# EAGLE board SparkFun_LTE_GNSS_Breakout_SARA-R510M8S (EAGLE 9.5.2)
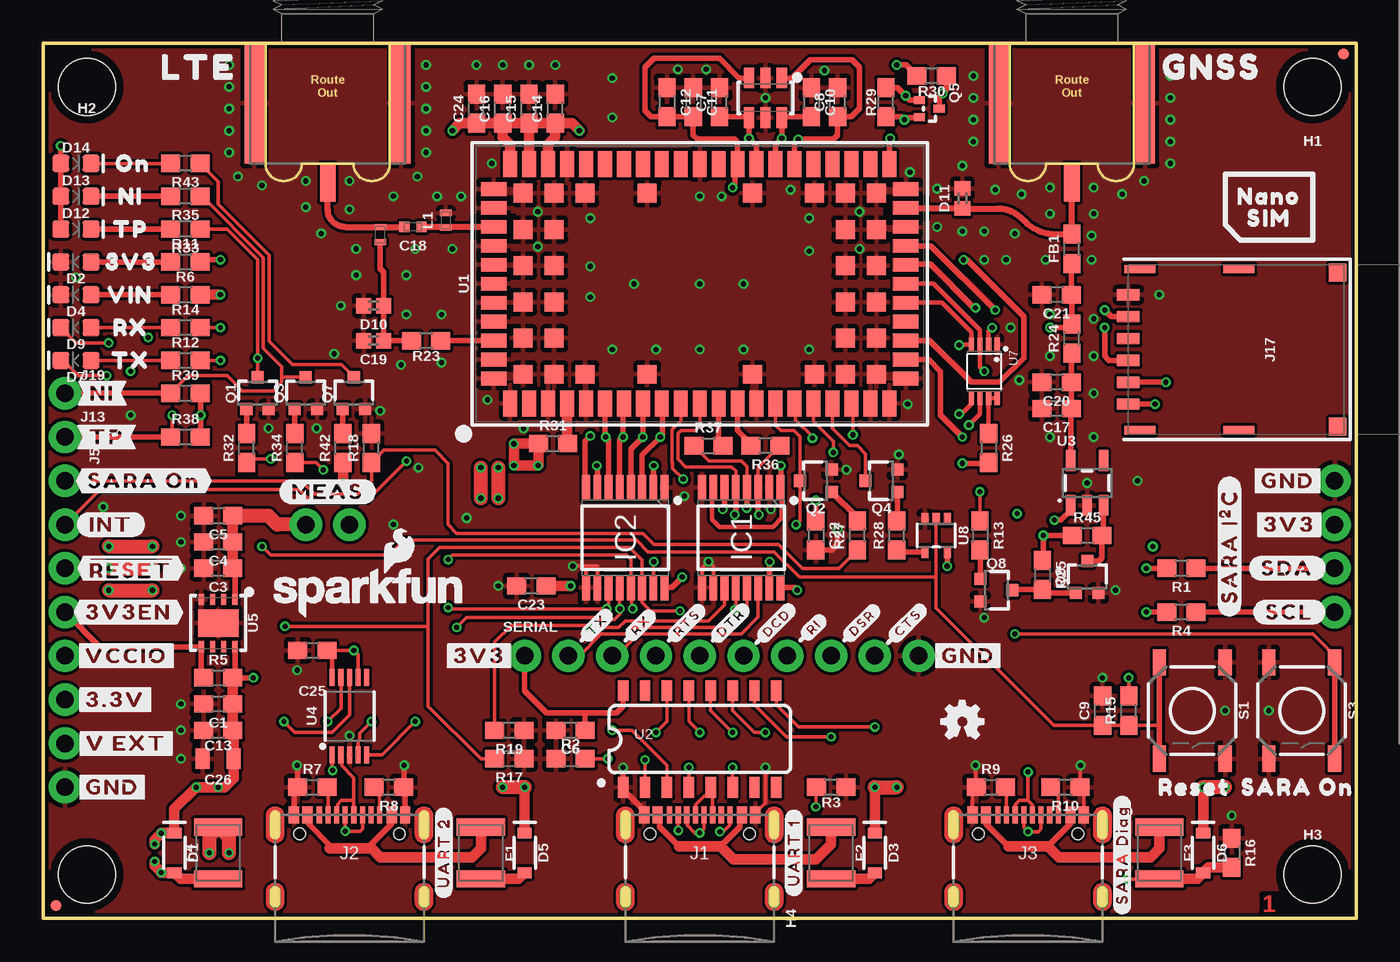
[diagram p1: board, top side]
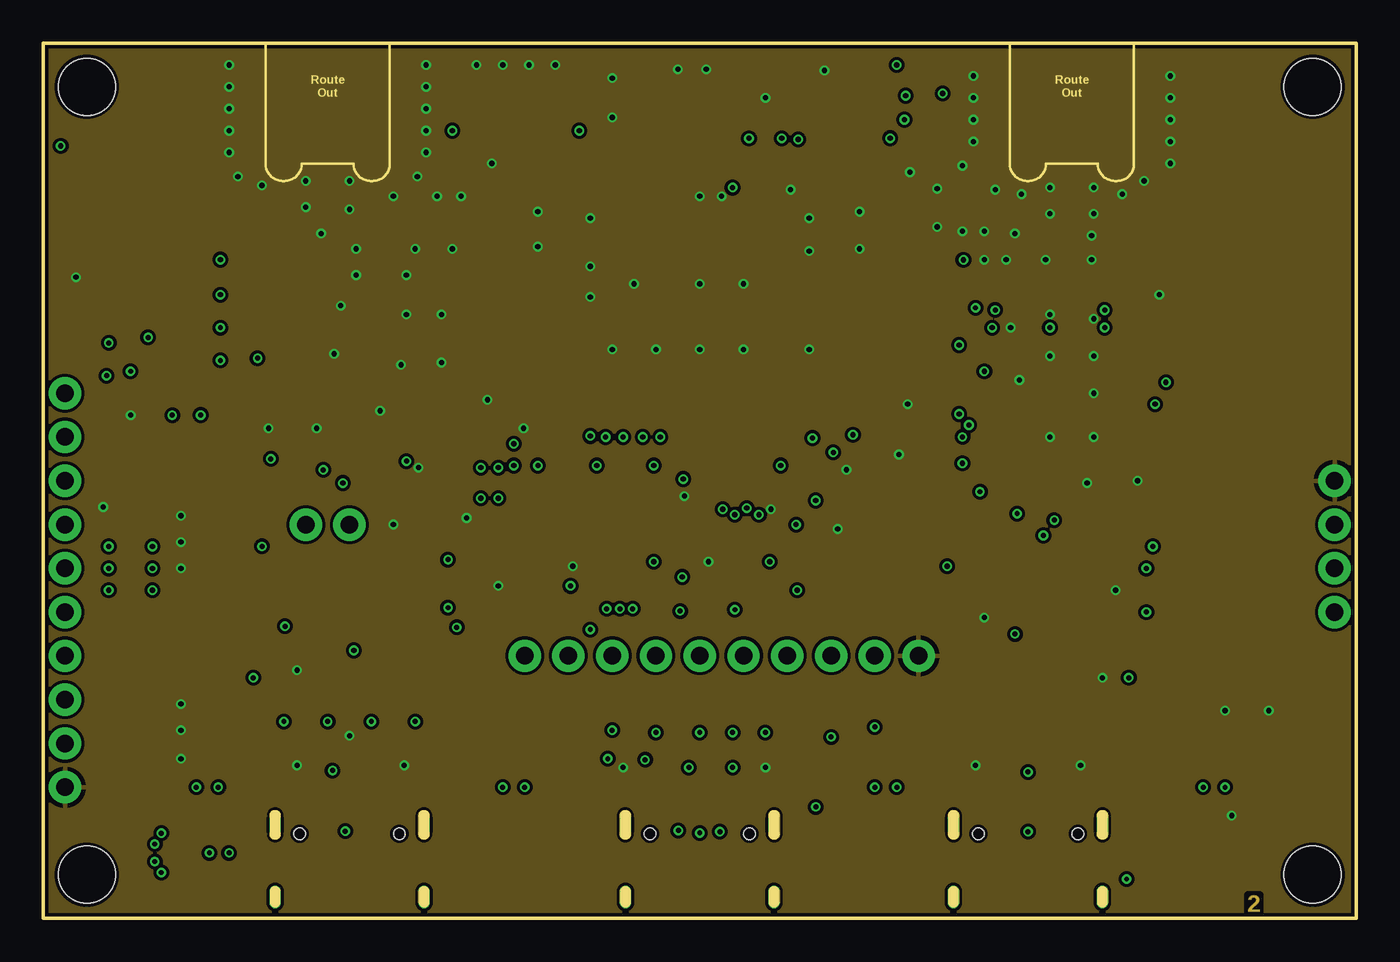
[diagram p2: board, inner layer Route2]
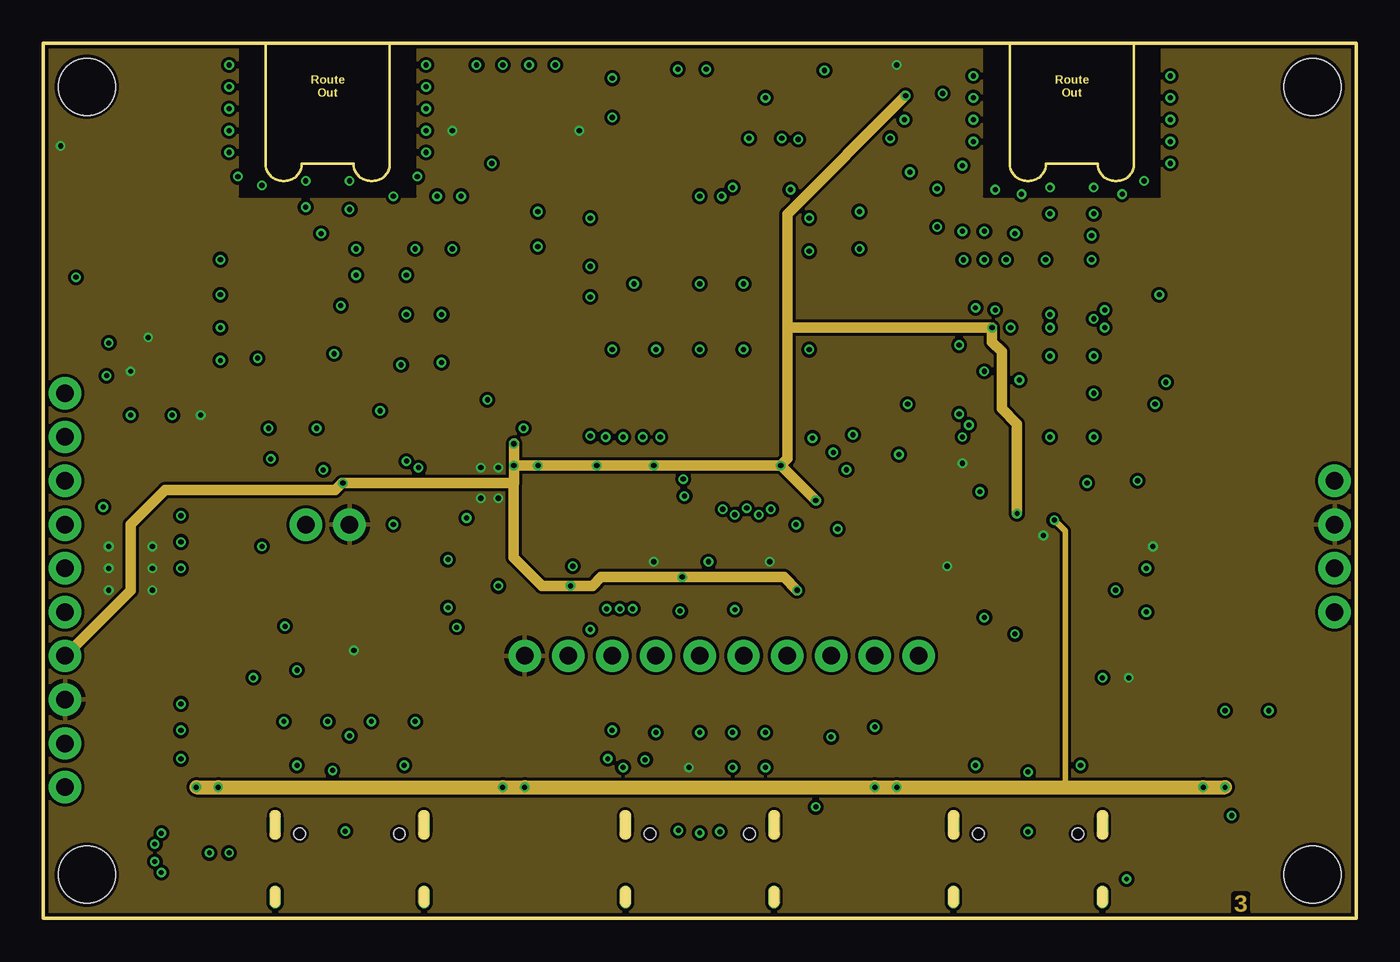
[diagram p3: board, inner layer Route15]
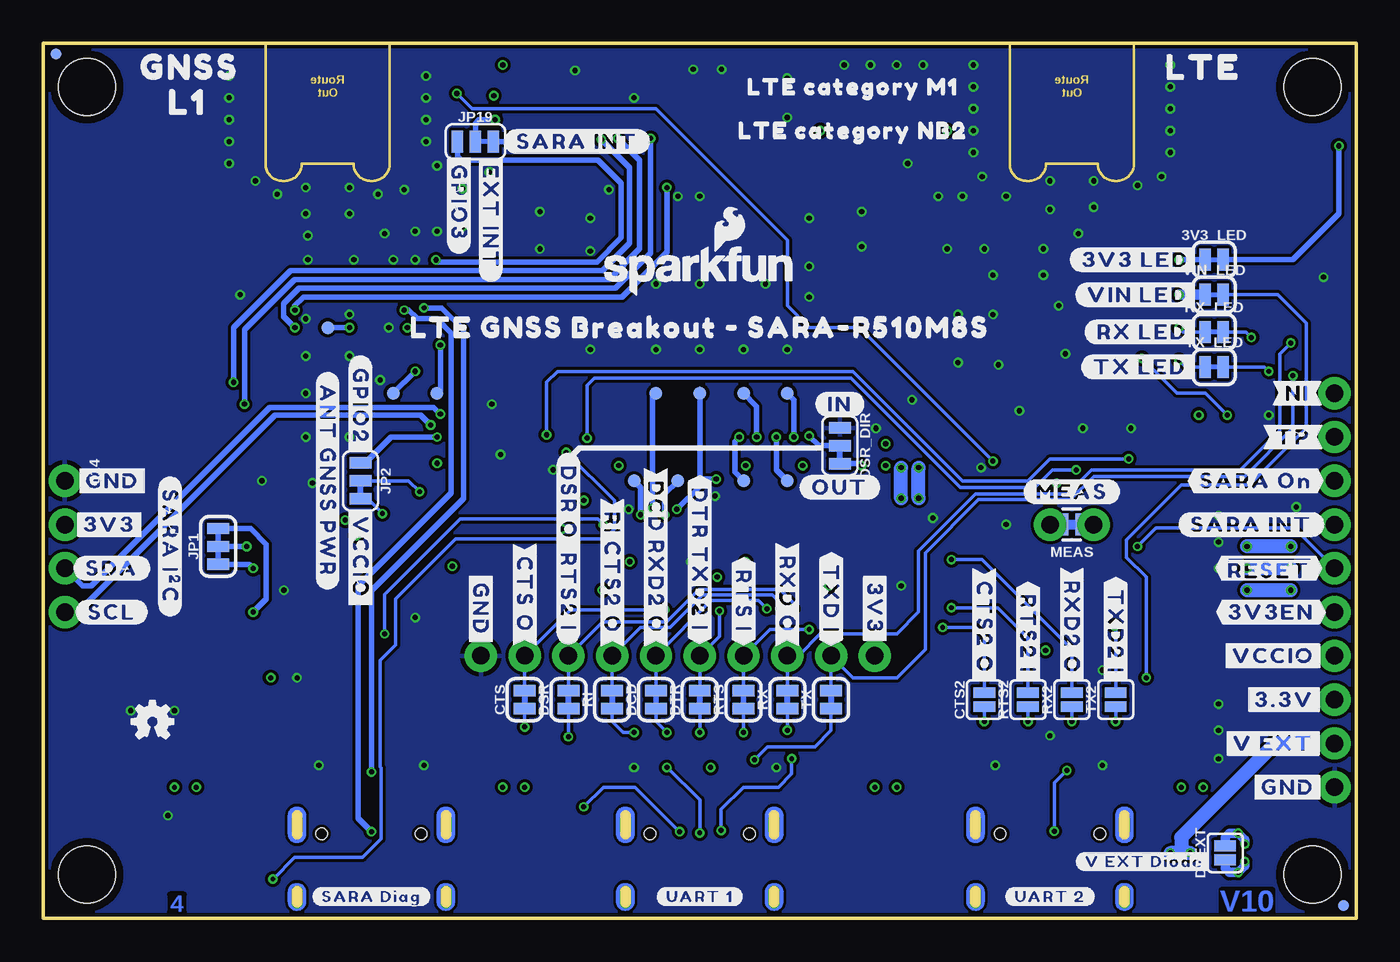
[diagram p4: board, bottom side, seen from below]

Size 76.2 x 50.8 mm. Coordinates in mm from the lower left corner, seen from the top.
Outline: 0,0 0,50.8 76.2,50.8 76.2,0 0,0
Copper layers (1+2*15+16): Top 0.035mm / dielectric 0.2mm / Route2 0.0175mm / dielectric 1.065mm / Route15 0.0175mm / dielectric 0.2mm / Bottom 0.035mm
Design rules "SparkFun-4-layer-1oz-JLCPCB": minimum track width 5mil, minimum drill 0.2mm, track to track 5mil, track to pad 0.2mm, pad to pad 5mil, via to via 0.2mm, smd to smd 0mil, copper to edge 0.2mm, drill to drill 10mil, minimum pad ring 0.13mm, minimum via ring 0.13mm, stop-mask expansion 0.05mm, vias tented up to drill 25mil, thermal gap 10mil
Net classes: 0 default: width 0 mm, drill 0 mm; 1 power: width 0.762 mm

## Footprints (pad centres in the part's own frame; a part is rotated, then mirrored left to right if it is on the bottom)
SMT-JUMPER_2_NC_TRACE_SILK = smd 0.66 x 1.27: 1 -0.521,0; 2 0.521,0
0603 = smd 1.1 x 1: 1 -0.85,0; 2 0.85,0
0402-TIGHT = smd 0.6 x 0.6: 1 -0.5,0; 2 0.5,0
0402 = smd 0.85 x 0.9: 1 -0.58,0; 2 0.58,0
0805 = smd 0.8 x 1.2: 1 -0.9,0; 2 0.9,0
SMT-JUMPER_2_NO_SILK = smd 0.635 x 1.27: 1 -0.406,0; 2 0.406,0
SOD-323 = smd 0.63 x 0.83: A 1.15,0; C -1.15,0
LED-0603 = smd 1 x 1: A -0.877,0; C 0.877,0
SOT23-6L = smd 0.6 x 1.2: 1 -0.95,-1.15; 2 0,-1.15; 3 0.95,-1.15; 4 0.95,1.15; 5 0,1.15; 6 -0.95,1.15
SMT-JUMPER_3_1-NC_TRACE_SILK = smd 0.66 x 1.27: 1 -1.041,0; 2 0,0; 3 1.041,0
SMA-EDGE-SMD = smd 1.15 x 7: GND@0 -4.25,-3.5; GND@1 4.25,-3.5 | smd 0.9 x 2.2: SIG 0,-8.1
1210 = smd 1 x 2.8: 1 -1.5,0; 2 1.5,0
FIDUCIAL-MICRO = smd 0.635 x 0.635: 1 0,0
STAND-OFF = hole 3.302: 0,0
SOP65P640X120-16N = smd 1.5 x 0.45: 1 -2.9,2.275; 2 -2.9,1.625; 3 -2.9,0.975; 4 -2.9,0.325; 5 -2.9,-0.325; 6 -2.9,-0.975; 7 -2.9,-1.625; 8 -2.9,-2.275; 9 2.9,-2.275; 10 2.9,-1.625; 11 2.9,-0.975; 12 2.9,-0.325; 13 2.9,0.325; 14 2.9,0.975; 15 2.9,1.625; 16 2.9,2.275
USB-C-16P_4LAYER-PADS = smd 0.3 x 1: A5 -1.25,-0.34; A6 -0.25,-0.34; A7 0.25,-0.34; A8 1.25,-0.34; B5 1.75,-0.34; B6 0.75,-0.34; B7 -0.75,-0.34; B8 -1.75,-0.34 | smd 0.6 x 1: GND -3.225,-0.34; GND2 3.225,-0.34; VBUS1 -2.45,-0.34; VBUS2 2.45,-0.34 | drill 0.4 pad 0.6 long: SHLD1 -4.318,-0.915; SHLD2 4.318,-0.915; SHLD3 -4.318,-5.095; SHLD4 4.318,-5.095 | hole 0.65: -2.89,-1.445; 2.89,-1.445
1X08_NO_SILK = drill 1.016 pad 1.88: 1 0,0; 2 2.54,0; 3 5.08,0; 4 7.62,0; 5 10.16,0; 6 12.7,0; 7 15.24,0; 8 17.78,0
1X01_NO_SILK = drill 1.016 pad 1.88: 1 0,0
1X04_NO_SILK = drill 1.016 pad 1.88: 1 0,0; 2 2.54,0; 3 5.08,0; 4 7.62,0
NANO_SIM_WURTH_693043020611 = smd 0.65 x 1.3: C1 1.905,6.25; C2 -0.635,6.25; C3 -1.905,6.25; C5 3.175,6.25; C6 0.635,6.25; C7 -3.175,6.25 | smd 0.48 x 1.8: MNT1 -4.69,5.58; MNT2 4.66,5.58; MNT3 -4.69,-0.17; MNT4 4.66,-0.17 | smd 1.03 x 1: MNT5 -4.465,-5.89; MNT6 4.465,-5.89
SMT-JUMPER_3_2-NC_TRACE_SILK = smd 0.66 x 1.27: 1 -1.041,0; 2 0,0; 3 1.041,0
0402_COILCRAFT = smd 0.356 x 0.66: P$1 -0.432,0; P$2 0.432,0
COMBO-JUMPER_2_NC_TRACE = smd 0.635 x 1.27: 1 -0.508,0; 2 0.508,0 | drill 1.016 pad 1.88: 3 -1.27,0; 4 1.27,0
SOT323 = smd 0.7 x 0.7: 1 -0.65,-0.925; 2 0.65,-0.925; 3 0,0.925
SOT-416FL = smd 0.46 x 0.65: 1 -0.5,-1.1; 2 0.5,-1.1; 3 0,0.05
TACTILE_SWITCH_SMD_5.2MM = smd 1.524 x 0.762: 1 -2.794,1.905; 2 2.794,1.905; 3 -2.794,-1.905; 4 2.794,-1.905
1X10_NO_SILK = drill 1.016 pad 1.88: 1 0,0; 2 2.54,0; 3 5.08,0; 4 7.62,0; 5 10.16,0; 6 12.7,0; 7 15.24,0; 8 17.78,0; 9 20.32,0; 10 22.86,0
PAD.03X.03 = smd 0.762 x 0.762: P$1 0,0
SARA-LGA = smd 0.8 x 1.5: 1 -11,-6.95; 2 -9.9,-6.95; 3 -8.8,-6.95; 4 -7.7,-6.95; 5 -6.6,-6.95; 6 -5.5,-6.95; 7 -4.4,-6.95; 8 -3.3,-6.95; 9 -2.2,-6.95; 10 -1.1,-6.95; 11 0,-6.95; 12 1.1,-6.95; 13 2.2,-6.95; 14 3.3,-6.95; 15 4.4,-6.95; 16 5.5,-6.95; 17 6.6,-6.95; 18 7.7,-6.95; 19 8.8,-6.95; 20 9.9,-6.95; 21 11,-6.95; 33 11,6.95; 34 9.9,6.95; 35 8.8,6.95; 36 7.7,6.95; 37 6.6,6.95; 38 5.5,6.95; 39 4.4,6.95; 40 3.3,6.95; 41 2.2,6.95; 42 1.1,6.95; 43 0,6.95; 44 -1.1,6.95; 45 -2.2,6.95; 46 -3.3,6.95; 47 -4.4,6.95; 48 -5.5,6.95; 49 -6.6,6.95; 50 -7.7,6.95; 51 -8.8,6.95; 52 -9.9,6.95; 53 -11,6.95 | smd 1.5 x 0.8: 22 11.95,-5.5; 23 11.95,-4.4; 24 11.95,-3.3; 25 11.95,-2.2; 26 11.95,-1.1; 27 11.95,0; 28 11.95,1.1; 29 11.95,2.2; 30 11.95,3.3; 31 11.95,4.4; 32 11.95,5.5; 54 -11.95,5.5; 55 -11.95,4.4; 56 -11.95,3.3; 57 -11.95,2.2; 58 -11.95,1.1; 59 -11.95,0; 60 -11.95,-1.1; 61 -11.95,-2.2; 62 -11.95,-3.3; 63 -11.95,-4.4; 64 -11.95,-5.5 | smd 1.1 x 1.1: 65 -10.25,-5.25; 66 -10.25,-3.15; 67 -10.25,-1.05; 68 -10.25,1.05; 69 -10.25,3.15; 70 -10.25,5.25; 71 -8.45,-5.25; 72 -8.45,-3.15; 73 -8.45,-1.05; 74 -8.45,1.05; 75 -8.45,3.15; 76 -8.45,5.25; 77 -6.65,-5.25; 78 -6.65,5.25; 79 -3.05,-5.25; 80 -3.05,5.25; 81 3.05,-5.25; 82 3.05,5.25; 83 6.65,-5.25; 84 6.65,5.25; 85 8.45,-5.25; 86 8.45,-3.15; 87 8.45,-1.05; 88 8.45,1.05; 89 8.45,3.15; 90 8.45,5.25; 91 10.25,-5.25; 92 10.25,-3.15; 93 10.25,-1.05; 94 10.25,1.05; 95 10.25,3.15; 96 10.25,5.25
SO016 = smd 0.6 x 1.2: 1 -4.445,-2.8; 2 -3.175,-2.8; 3 -1.905,-2.8; 4 -0.635,-2.8; 5 0.635,-2.8; 6 1.905,-2.8; 7 3.175,-2.8; 8 4.445,-2.8; 9 4.445,2.8; 10 3.175,2.8; 11 1.905,2.8; 12 0.635,2.8; 13 -0.635,2.8; 14 -1.905,2.8; 15 -3.175,2.8; 16 -4.445,2.8
SOT23-5 = smd 0.55 x 1.2: 1 -0.95,-1.3; 2 0,-1.3; 3 0.95,-1.3; 4 0.95,1.3; 5 -0.95,1.3
MSOP10 = smd 1 x 0.3: 1 -2.25,1; 2 -2.25,0.5; 3 -2.25,0; 4 -2.25,-0.5; 5 -2.25,-1; 6 2.25,-1; 7 2.25,-0.5; 8 2.25,0; 9 2.25,0.5; 10 2.25,1
UDFN-8 = smd 0.3 x 0.65: 1 -0.975,-1.375; 2 -0.325,-1.375; 3 0.325,-1.375; 4 0.975,-1.375; 5 0.975,1.375; 6 0.325,1.375; 7 -0.325,1.375; 8 -0.975,1.375 | smd 2.35 x 1.6: EP 0,0
VSSOP_8PIN = smd 0.8 x 0.3: P1 -1.55,0.75; P2 -1.55,0.25; P3 -1.55,-0.25; P4 -1.55,-0.75; P5 1.55,-0.75; P6 1.55,-0.25; P7 1.55,0.25; P8 1.55,0.75
SOT353 = smd 0.42 x 0.7: 1 -0.65,-0.95; 2 0,-0.95; 3 0.65,-0.95; 4 0.65,0.95; 5 -0.65,0.95

## Placement (x,y rotation side)
3V3_LED  [SMT-JUMPER_2_NC_TRACE_SILK]  8.26,38.23 0 bottom
C1  0.1uF  [0603]  10.16,12.45 180 top
C3  4.7uF  [0603]  10.16,20.32 180 top
C4  0.1uF  [0603]  10.16,21.84 180 top
C5  0.22uF  [0603]  10.16,23.37 180 top
C6  0.1uF  [0603]  30.61,10.92 180 top
C7  47pF  [0603]  39.24,47.37 90 top
C8  47pF  [0603]  46.1,47.37 90 top
C9  0.1uF  [0603]  61.47,12.06 90 top
C10  47pF  [0603]  44.58,47.37 270 top
C11  47pF  [0603]  37.72,47.37 270 top
C12  0.1uF  [0603]  36.2,47.37 270 top
C13  0.22uF  [0603]  10.16,10.92 180 top
C14  0.1uF  [0603]  29.72,46.99 90 top
C15  68pF  [0603]  28.19,46.99 90 top
C16  10uF  [0603]  26.67,46.99 90 top
C17  1.0uF  [0603]  58.8,29.59 180 top
C18  33pF  [0402-TIGHT]  21.46,40.13 180 top
C19  27pF  [0402]  19.18,33.53 180 top
C20  0.1uF  [0603]  58.8,31.11 180 top
C21  47pF  [0603]  58.8,36.2 180 top
C22  0.1uF  [0603]  44.83,22.23 270 top
C23  0.1uF  [0603]  28.32,19.3 180 top
C24  15pF  [0603]  25.15,46.99 90 top
C25  0.1uF  [0603]  15.62,15.56 180 top
C26  10uF  [0805]  10.16,9.27 180 top
CTS  JUMPER-SMT_2_NC_TRACE_SILK  [SMT-JUMPER_2_NC_TRACE_SILK]  48.26,12.7 90 bottom
CTS2  JUMPER-SMT_2_NO_SILK  [SMT-JUMPER_2_NO_SILK]  21.59,12.7 90 bottom
D1  3A/10V/280mV  [SOD-323]  7.62,3.81 270 top
D2  RED  [LED-0603]  1.91,38.1 180 top
D3  3A/10V/280mV  [SOD-323]  48.26,3.81 270 top
D4  Yellow  [LED-0603]  1.91,36.2 180 top
D5  3A/10V/280mV  [SOD-323]  27.94,3.81 270 top
D6  3A/10V/280mV  [SOD-323]  67.31,3.81 270 top
D7  GREEN  [LED-0603]  1.91,32.38 180 top
D8  DT1042-04SO-7  [SOT23-6L]  41.91,47.62 180 top
D9  Yellow  [LED-0603]  1.91,34.29 180 top
D10  PESD0402  [0402]  19.18,35.56 180 top
D11  PESD0402  [0402]  53.34,41.78 90 top
D12  GREEN  [LED-0603]  1.91,40.01 0 top
D13  BLUE  [LED-0603]  1.91,41.91 0 top
D14  WHITE  [LED-0603]  1.91,43.81 0 top
DCD  JUMPER-SMT_2_NC_TRACE_SILK  [SMT-JUMPER_2_NC_TRACE_SILK]  40.64,12.7 90 bottom
DSR  JUMPER-SMT_2_NC_TRACE_SILK  [SMT-JUMPER_2_NC_TRACE_SILK]  45.72,12.7 90 bottom
DSR_DIR  JUMPER-SMT_3_1-NC_TRACE_SILK  [SMT-JUMPER_3_1-NC_TRACE_SILK]  29.97,27.43 270 bottom
DTR  JUMPER-SMT_2_NC_TRACE_SILK  [SMT-JUMPER_2_NC_TRACE_SILK]  38.1,12.7 90 bottom
DVEXT  JUMPER-SMT_2_NO_SILK  [SMT-JUMPER_2_NO_SILK]  7.62,3.81 90 bottom
E3  ANTENNA-SMA-GROUNDEDEDGE_SMA_SMD  [SMA-EDGE-SMD]  16.51,50.8 0 top
E4  ANTENNA-SMA-GROUNDEDEDGE_SMA_SMD  [SMA-EDGE-SMD]  59.69,50.8 0 top
F1  6V/2A  [1210]  25.4,3.81 270 top
F2  6V/2A  [1210]  45.72,3.81 270 top
F3  6V/2A  [1210]  64.77,3.81 270 top
F4  6V/2A  [1210]  10.16,3.81 90 top
FB1  30Ω/1.8A  [0603]  59.69,38.86 90 top
FD1  FIDUCIALUFIDUCIAL  [FIDUCIAL-MICRO]  0.76,0.76 0 top
FD2  FIDUCIALUFIDUCIAL  [FIDUCIAL-MICRO]  75.44,50.16 0 top
FD3  FIDUCIALUFIDUCIAL  [FIDUCIAL-MICRO]  0.76,0.76 0 bottom
FD4  FIDUCIALUFIDUCIAL  [FIDUCIAL-MICRO]  75.44,50.16 0 bottom
FRAME1  FRAME-LEDGER  [CREATIVE_COMMONS]  106.68,1.27 0 top  (outside the outline)
H1  STAND-OFF  [STAND-OFF]  73.66,48.26 0 top
H2  STAND-OFF  [STAND-OFF]  2.54,48.26 0 top
H3  STAND-OFF  [STAND-OFF]  73.66,2.54 0 top
H4  STAND-OFF  [STAND-OFF]  2.54,2.54 0 top
IC1  SN74AVC4T774PW  [SOP65P640X120-16N]  40.51,22.1 270 top
IC2  SN74AVC4T774PW  [SOP65P640X120-16N]  33.78,22.1 270 top
J1  [USB-C-16P_4LAYER-PADS]  38.1,6.35 0 top
J2  [USB-C-16P_4LAYER-PADS]  17.78,6.35 0 top
J3  [USB-C-16P_4LAYER-PADS]  57.15,6.35 0 top
J5  [1X08_NO_SILK]  1.27,25.4 270 top
J13  TP  [1X01_NO_SILK]  1.27,27.94 0 top
J14  [1X04_NO_SILK]  74.93,25.4 270 bottom
J17  NANO_SIM  [NANO_SIM_WURTH_693043020611]  69.22,33.02 90 top
J19  NI  [1X01_NO_SILK]  1.27,30.48 0 top
JP1  [SMT-JUMPER_3_2-NC_TRACE_SILK]  66.04,21.59 90 bottom
JP2  JUMPER-SMT_3_1-NC_TRACE_SILK  [SMT-JUMPER_3_1-NC_TRACE_SILK]  57.78,25.4 270 bottom
JP19  JUMPER-SMT_3_1-NC_TRACE_SILK  [SMT-JUMPER_3_1-NC_TRACE_SILK]  51.12,45.09 0 bottom
L1  DNP  [0402_COILCRAFT]  23.37,40.51 90 top
L2  68nH  [0402_COILCRAFT]  19.56,39.69 90 top
LOGO1  SFE_LOGO_NAME_FLAME.1_INCH  [SFE_LOGO_NAME_FLAME_.1]  18.92,18.92 0 top
LOGO2  OSHW-LOGOMINI  [OSHW-LOGO-MINI]  69.85,11.43 0 bottom
LOGO3  OSHW-LOGOMINI  [OSHW-LOGO-MINI]  53.34,11.43 0 top
LOGO4  SFE_LOGO_NAME_FLAME.1_INCH  [SFE_LOGO_NAME_FLAME_.1]  38.1,37.59 0 bottom
LOGO5  SPECIAL_INSTRUCTIONS-ORDERING  [ORDERING_INSTRUCTIONS]  78.74,60.96 0 top  (outside the outline)
MEAS  [COMBO-JUMPER_2_NC_TRACE]  16.51,22.86 180 bottom
Q1  310mA/60V/1.6Ω  [SOT323]  12.45,30.48 0 top
Q2  310mA/60V/1.6Ω  [SOT323]  44.83,25.4 90 top
Q3  310mA/60V/1.6Ω  [SOT323]  15.24,30.48 0 top
Q4  310mA/60V/1.6Ω  [SOT323]  48.64,25.4 90 top
Q5  20V/0.2A/8MHz/1.2Ω/1Vth  [SOT-416FL]  51.94,46.99 270 top
Q7  310mA/60V/1.6Ω  [SOT323]  18.03,30.48 0 top
Q8  310mA/60V/1.6Ω  [SOT323]  55.31,19.05 270 top
Q9  310mA/60V/1.6Ω  [SOT323]  60.58,19.81 0 top
R1  2.2k  [0603]  66.04,20.32 180 top
R2  5.1k  [0603]  30.61,9.27 0 top
R3  5.1k  [0603]  45.72,7.62 180 top
R4  2.2k  [0603]  66.04,17.78 180 top
R5  100k  [0603]  10.16,13.97 0 top
R6  4.7k  [0603]  8.26,36.2 0 top
R7  5.1k  [0603]  15.62,7.62 0 top
R8  5.1k  [0603]  20.07,7.62 180 top
R9  5.1k  [0603]  54.99,7.62 0 top
R10  5.1k  [0603]  59.31,7.62 180 top
R11  1k  [0603]  8.26,38.1 0 top
R12  4.7k  [0603]  8.26,32.38 0 top
R13  1k  [0603]  54.36,22.23 270 top
R14  4.7k  [0603]  8.26,34.29 0 top
R15  100k  [0603]  62.99,12.06 90 top
R16  5.1k  [0603]  68.96,3.81 270 top
R17  100k  [0603]  27.05,9.27 180 top
R18  100k  [0603]  19.05,27.3 90 top
R19  100k  [0603]  27.05,10.92 180 top
R23  10k  [0603]  22.23,33.53 180 top
R24  10  [0603]  59.69,33.66 90 top
R25  100k  [0603]  57.98,19.94 270 top
R26  200k  [0603]  54.86,27.3 270 top
R27  1k  [0603]  47.24,22.23 90 top
R28  1k  [0603]  49.53,22.23 90 top
R29  2.2k  [0603]  48.9,47.37 90 top
R30  2.2k  [0603]  51.56,48.9 180 top
R31  0  [0603]  29.59,27.56 0 top
R32  1k  [0603]  11.81,27.3 90 top
R33  100  [0603]  8.26,40.01 180 top
R34  1k  [0603]  14.61,27.3 90 top
R35  470  [0603]  8.26,41.91 180 top
R36  0  [0603]  41.91,27.43 180 top
R37  0  [0603]  38.61,27.43 0 top
R38  100k  [0603]  8.26,27.94 0 top
R39  100k  [0603]  8.26,30.48 0 top
R42  1k  [0603]  17.4,27.3 90 top
R43  1k  [0603]  8.26,43.81 180 top
R45  100k  [0603]  60.58,22.23 0 top
RI  JUMPER-SMT_2_NC_TRACE_SILK  [SMT-JUMPER_2_NC_TRACE_SILK]  43.18,12.7 90 bottom
RTS  JUMPER-SMT_2_NC_TRACE_SILK  [SMT-JUMPER_2_NC_TRACE_SILK]  35.56,12.7 90 bottom
RTS2  JUMPER-SMT_2_NO_SILK  [SMT-JUMPER_2_NO_SILK]  19.05,12.7 90 bottom
RX  JUMPER-SMT_2_NC_TRACE_SILK  [SMT-JUMPER_2_NC_TRACE_SILK]  33.02,12.7 90 bottom
RX2  JUMPER-SMT_2_NO_SILK  [SMT-JUMPER_2_NO_SILK]  16.51,12.7 90 bottom
RX_LED  [SMT-JUMPER_2_NC_TRACE_SILK]  8.26,34.04 0 bottom
S1  RESET  [TACTILE_SWITCH_SMD_5.2MM]  66.67,12.06 270 top
S3  SARA_PWR  [TACTILE_SWITCH_SMD_5.2MM]  73.03,12.06 270 top
SERIAL  [1X10_NO_SILK]  27.94,15.24 0 top
TP1  TEST-POINT3  [PAD.03X.03]  41.91,25.4 0 bottom
TP2  TEST-POINT3  [PAD.03X.03]  40.64,30.48 0 bottom
TP3  TEST-POINT3  [PAD.03X.03]  39.37,25.4 0 bottom
TP4  TEST-POINT3  [PAD.03X.03]  38.1,30.48 0 bottom
TP9  TEST-POINT3  [PAD.03X.03]  53.34,30.48 0 bottom
TP10  TEST-POINT3  [PAD.03X.03]  55.88,30.48 0 bottom
TP14  TEST-POINT3  [PAD.03X.03]  35.56,25.4 0 bottom
TP15  TEST-POINT3  [PAD.03X.03]  35.56,30.48 0 bottom
TP16  TEST-POINT3  [PAD.03X.03]  33.02,25.4 0 bottom
TP17  TEST-POINT3  [PAD.03X.03]  33.02,30.48 0 bottom
TP22  TEST-POINT3  [PAD.03X.03]  59.69,34.29 0 bottom
TX  JUMPER-SMT_2_NC_TRACE_SILK  [SMT-JUMPER_2_NC_TRACE_SILK]  30.48,12.7 90 bottom
TX2  JUMPER-SMT_2_NO_SILK  [SMT-JUMPER_2_NO_SILK]  13.97,12.7 90 bottom
TX_LED  [SMT-JUMPER_2_NC_TRACE_SILK]  8.26,32 0 bottom
U1  SARA-R510M8S  [SARA-LGA]  38.1,36.83 0 top
U2  CH340C  [SO016]  38.1,10.41 0 top
U3  3.3V  [SOT23-5]  60.58,25.27 0 top
U4  CH340E_MSOP10  [MSOP10]  17.78,11.75 90 top
U5  AP7361C-33FGE  [UDFN-8]  10.16,17.14 180 top
U7  PCA9306  [VSSOP_8PIN]  54.61,31.75 270 top
U8  74HC1G04  [SOT353]  51.82,22.23 180 top
U$1  [#3V3#1]  23.11,15.24 0 top
U$2  [#3V3#1]  27.94,20.19 270 bottom
U$3  [#3V3#1]  70.1,22.86 0 top
U$4  [#TX_LED#0]  12.57,32 0 bottom
U$5  [#SARA_I�C#0]  68.83,21.59 90 top
U$6  [#V_EXT#0]  4.83,10.16 0 top
U$7  [#V_EXT#0]  4.83,10.16 0 bottom
U$8  [#3V3EN#0]  4.95,17.78 0 top
U$9  [#3V3EN#0]  4.95,17.78 0 bottom
U$10  [##RESET##0]  5.08,20.32 0 top
U$11  [#3V3#1]  74.55,22.86 0 bottom
U$12  [#GND#0]  69.98,25.4 0 top
U$13  [##RESET##0]  5.08,20.32 0 bottom
U$14  [#INT#0]  3.94,22.86 0 top
U$15  [#SARA_INT#0]  6.1,22.86 0 bottom
U$16  [#SARA_ON#0]  5.84,25.4 0 top
U$17  [#SARA_ON#0]  5.84,25.4 0 bottom
U$18  [RX0]  5.08,34.29 0 top
U$19  [#MEAS#2]  13.72,24.77 0 top
U$20  [#RX_LED#0]  12.45,34.04 0 bottom
U$21  [TX0]  5.08,32.38 0 top
U$22  [#GND#0]  74.42,25.4 0 bottom
U$23  [#SARA_I�C#0]  68.83,21.59 270 bottom
U$24  [#TX#0]  32.13,17.02 45 top
U$25  [#RX#0]  34.67,17.02 45 top
U$26  [#SCL#3]  70.23,17.78 0 top
U$27  [#SCL#3]  74.3,17.78 0 bottom
U$28  [#RTS#0]  37.34,17.14 45 top
U$29  [#DTR#0]  39.88,17.14 45 top
U$30  [#SDA#2]  69.98,20.32 0 top
U$31  [#DCD#0]  42.55,17.14 45 top
U$32  [#RI#0]  44.7,16.89 45 top
U$33  [#DSR#0]  47.5,17.14 45 top
U$34  [#CTS#0]  50.16,17.14 45 top
U$35  [#RXD_O#0]  33.02,18.8 270 bottom
U$36  [3V37]  2.92,38.1 0 top
U$37  [#SDA#2]  74.42,20.32 0 bottom
U$38  [#TXD_I#0]  30.48,18.54 270 bottom
U$39  [#CTS_O#0]  48.26,18.8 270 bottom
U$40  [#RTS_I#0]  35.56,18.41 270 bottom
U$41  [#DTR_TXD2_I#0]  38.1,20.83 270 bottom
U$42  [L10]  67.82,47.37 0 bottom
U$43  [#DCD_RXD2_O#0]  40.64,20.95 270 bottom
U$44  [#RXD2_O#0]  16.51,16.89 270 bottom
U$45  [RESET6]  64.01,7.62 0 top
U$46  [VIN8]  3.05,36.2 0 top
U$47  [#RI_CTS2_O#0]  43.18,20.07 270 bottom
U$48  [#CTS2_O#0]  21.59,16.89 270 bottom
U$49  [#DSR_O__RTS2_I#0]  45.72,21.46 270 bottom
U$50  [#RTS2_I#0]  19.05,16.51 270 bottom
U$51  [#V_EXT_DIODE#0]  12.32,3.3 0 bottom
U$52  [#OUT#0]  29.97,25.02 0 bottom
U$53  [#IN#0]  29.97,29.84 0 bottom
U$54  [#VIN_LED#0]  12.7,36.2 0 bottom
U$55  [#GND#4]  50.8,20.19 270 bottom
U$56  [#GND#4]  51.44,15.24 0 top
U$57  [#TP#0]  3.68,27.94 0 top
U$58  [#TP#0]  3.68,27.94 0 bottom
U$59  [#NI#0]  3.43,30.48 0 top
U$60  [#NI#0]  3.43,30.48 0 bottom
U$61  [#3V3_LED#0]  12.83,38.23 0 bottom
U$62  [#UART_2#0]  23.24,3.81 90 top
U$63  [#UART_2#0]  17.78,1.27 0 bottom
U$64  [#UART_1#0]  38.1,1.27 0 bottom
U$65  [#UART_1#0]  43.56,3.81 90 top
U$66  [#SARA_DIAG#0]  57.15,1.27 0 bottom
U$67  [#SARA_DIAG#0]  62.61,3.68 90 top
U$68  [#VCCIO#0]  57.78,20.95 270 bottom
U$69  [#GPIO2#0]  57.78,29.72 270 bottom
U$70  [#ANT_GNSS_PWR#0]  59.69,25.4 270 bottom
U$71  [#SARA_INT#0]  45.21,45.09 0 bottom
U$72  [#TXD2_I#0]  13.97,16.64 270 bottom
U$73  [LTE_CATEGORY_M10]  29.21,48.26 0 bottom
U$74  [LTE_CATEGORY_NB20]  29.21,45.72 0 bottom
U$75  [LTE_GNSS_BREAKOUT_#_SARA#R510M8S0]  38.1,34.29 0 bottom
U$76  [#3#3V#0]  4.19,12.7 0 top
U$79  [#3#3V#0]  4.19,12.7 0 bottom
U$80  [#VCCIO#0]  4.83,15.24 0 top
U$81  [#GND#4]  1.78,7.62 0 top
U$82  [#GND#4]  6.22,7.62 0 bottom
U$83  [#VCCIO#0]  4.83,15.24 0 bottom
U$87  [#MEAS#2]  19.3,24.77 0 bottom
U$88  [LTE0]  9.02,49.4 0 top
U$89  [LTE0]  8.89,49.4 0 bottom
U$90  [NI0]  5.08,41.91 0 top
U$91  [TP0]  5.08,40.01 0 top
U$99  [GNSS0]  67.82,49.4 0 top
U$100  [GNSS0]  67.69,49.4 0 bottom
U$101  [ON0]  5.21,43.81 0 top
U$113  [SARA_ON0]  72.77,7.62 0 top
U$118  [#EXT_INT#0]  50.23,40.7 270 bottom
U$119  [#GPIO3#0]  52.07,41.53 270 bottom
U$130  [NANO0]  71.12,41.91 0 top
U$131  [SIM0]  71.12,40.64 0 top
VIN_LED  [SMT-JUMPER_2_NC_TRACE_SILK]  8.26,36.2 0 bottom

## Tracks (layer width: path | path; a pad name or v marks a point on that pad's centre or on a via)
3.3V  (via drill 0.28, 0.3)
  Top 0.203: U2.4 v37.47,8.76 | IC2.15 35.41,20.68 v35.43,20.7 | C25.1 v18.03,15.56 18.28,15.31 U4.7 | R15.2 v62.99,13.97
  Top 0.254: U4.10 16.78,15.25 C25.1
  Top 0.305: D12.A D13.A D14.A 1.02,43.83 v1.02,44.83 | R38.2 9.14,27.98 v9.14,29.21 9.14,30.44 R39.2 | R30.2 50.08,49.53 v49.53,49.53 | R26.2 54.83,26.42 v53.34,26.42 | U8.5 52.47,20.46 v52.45,20.45 | v42.16,20.7 42.14,20.68 IC1.15 | R25.1 58.04,20.85 v58.04,22.23 R45.1 | SERIAL.1 27.94,13.21 29.21,11.94 31.46,11.94 | U2.16 33.66,12.32 33.27,11.94 31.46,11.94 | C6.1 31.46,11.94
  Top 0.61: v31.11,45.72 30.7,46.14 C14.1 | C14.1 C15.1 | C15.1 C16.1 | U1.53 27.1,44.91 26.67,45.34 C16.1 | U1.52 C15.1 | U1.51 29.3,44.92 29.72,45.34 C14.1 | v23.75,45.72 24.17,46.14 C24.1 C16.1
  Top 0.813: v3.81,21.59 v6.35,21.59 | v3.81,20.32 v6.35,20.32 | v3.81,19.05 v6.35,19.05 | v25.4,24.38 v25.4,26.16 | v26.42,24.38 v26.42,26.16
  Bottom 0.203: TX_LED.2 5.33,32 v5.08,31.75 | RX_LED.2 6.42,34.04 v6.1,33.72
  Bottom 0.305: 3V3_LED.2 3.68,38.23 1.02,40.89 v1.02,44.83 | v64.39,21.59 JP1.2 | MEAS.2 MEAS.4
  Bottom 0.813: v25.4,24.38 v25.4,26.15 | v26.42,24.38 v26.42,26.16 | v3.81,21.59 v6.35,21.59 | v3.81,20.32 v6.35,20.32 | v3.81,19.05 v6.35,19.05
  pour Route15 (isolate 0.178, rank 3): 0,0 0,50.8 76.2,50.8 76.2,0
  cutout Route15 (isolate 0.203): 11.43,50.8 11.43,41.91 21.59,41.91 21.59,50.8
  cutout Route15 (isolate 0.203): 54.61,50.8 54.61,41.91 64.77,41.91 64.77,50.8
3.3V_EN
  Top 0.305: J5.4 3.28,15.77 U5.5 9.19,14.1 R5.1
!RESET!  (via drill 0.28)
  Top 0.203: 51.82,19.81 U8.2 | 64.77,11.3 64.68,11.21 R15.1 C9.1 58.63,11.21 51.82,18.03 51.82,19.81 | 51.82,19.81 43.88,19.81 42.41,21.28 35.1,21.28 34.42,21.97 20.95,21.97 20.07,21.08 13.21,21.08 v12.7,21.59
  Top 0.305: S1.3 64.77,11.3 S1.4
  Bottom 0.203: J5.3 3.61,22.66 11.63,22.66 v12.7,21.59
ANT_REG_EN
  Top 0.305: Q9.3 61.25,20.74 61.43,20.92 R45.2 61.53,22.32 U3.3
CTS  (via drill 0.28)
  Top 0.203: IC1.12 40.19,17.97 v40.14,17.92
  Bottom 0.203: CTS.2 SERIAL.9 45.59,17.91 40.15,17.91 v40.14,17.92
DCD  (via drill 0.28)
  Top 0.203: v34.21,17.97 34.15,18.03 34.15,19.16 IC2.13 34.11,20.82 33.85,21.08 23.75,21.08 v23.5,20.83
  Bottom 0.203: DCD.2 SERIAL.6 37.44,18.44 34.68,18.44 v34.21,17.97 | v23.5,20.83 21.72,20.83 16.51,15.62 RX2.2
DSR  (via drill 0.28)
  Top 0.203: IC2.11 32.81,18.07 v32.7,17.97 23.56,17.97 v23.5,18.03
  Bottom 0.203: DSR.2 SERIAL.8 43.75,17.21 40.04,17.21 38.15,19.1 33.45,19.1 32.7,18.35 v32.7,17.97 | v23.5,18.03 20.8,18.03 19.05,16.28 RTS2.2
DTR  (via drill 0.28)
  Top 0.203: v36.96,17.85 35.24,17.85 34.76,18.33 IC2.14 34.76,20.8 34.02,21.54 23.01,21.54 22.35,20.88 22.35,16.95 | R17.2 25.4,9.27 22.35,12.32 22.35,16.95 | 22.35,16.95 v14.03,16.95
  Bottom 0.203: DTR.2 SERIAL.5 36.96,16.38 v36.96,17.85 | v14.03,16.95 13.97,16.89 TX2.2
GND  (via drill 0.3)
  Top 0.203: J3.GND 53.92,7.4 R9.1 54.1,7.66 v54.1,8.89 | J3.GND2 60.38,7.4 R10.1 60.2,7.66 v60.2,8.89 | IC2.9 31.51,20.45 v30.73,20.45 32.16,20.45 IC2.10 | IC1.9 38.24,20.33 v38.61,20.7 38.89,20.42 IC1.10 | J1.GND2 41.33,6.14 41.91,6.72 v41.91,8.76
  Top 0.305: C22.2 45.76,21.38 46.1,21.72 v46.1,22.61 | J2.GND 14.55,7.4 R7.1 14.77,8.85 v14.73,8.89 | J2.GND2 21,7.53 R8.1 20.95,7.66 v20.95,8.89 | v33.66,8.76 U2.1 33.66,7.48 34.88,6.26 J1.GND
  other vias: 26.67,49.53 28.19,49.53 29.72,49.53 33.02,48.77 33.02,46.48 28.7,41.02 31.75,40.64 31.75,37.85 31.75,36.07 33.02,33.02 38.1,36.83 44.45,40.64 44.45,33.02 35.56,33.02 40.64,33.02 38.1,33.02 38.1,41.91 39.37,41.91 34.29,36.83 40.64,36.83 23.75,38.86 21.59,38.86 18.16,38.86 16.13,39.75 15.24,41.27 15.24,42.8 17.78,42.8 17.78,41.15 20.32,41.91 22.86,41.91 16.89,32.77 21.08,35.05 25.78,30.1 50.16,29.84 53.34,43.69 50.29,43.31 55.24,42.29 56.77,42.04 51.88,40.13 54.61,39.88 56.39,39.75 58.42,42.42 60.96,42.42 60.83,39.62 58.42,35.05 56.64,31.24 64.77,36.2 65.41,48.9 65.41,46.35 65.41,43.81 45.34,49.21 41.91,47.62 60.58,25.27 54.61,17.46 26.42,19.3 1.91,37.21 19.56,29.46 15.88,28.45 13.08,28.45 53.98,46.35 53.98,48.9 22.23,49.53 22.23,46.99 22.23,44.45 10.79,44.45 10.79,46.99 10.79,49.53 12.7,42.55 36.83,49.28 38.48,49.28 46.61,26.04 49.66,26.92 37.21,24.51 5.08,29.21 10.79,48.26 10.79,45.72 22.23,48.26 22.23,45.72 21.72,43.05 11.3,43.05 26.04,43.81 28.7,38.99 24.26,41.91 53.98,47.62 53.98,45.09 53.34,39.88 51.88,42.35 65.41,47.62 65.41,45.09 62.61,42.04 63.88,42.8 60.96,40.89 47.37,41.02 44.45,38.73 43.37,42.29 47.37,38.86 60.83,38.23 60.96,34.8 60.96,32.64 60.96,30.48 60.96,27.94 58.42,27.94 63.5,25.4 58.42,32.64 58.42,40.89 58.17,38.23 55.88,38.23 54.61,38.23 21.08,37.34 23.11,35.05 18.16,37.34 17.27,35.56 20.76,32.13 23.11,32.26 42.23,23.75 25.15,49.53 27.88,28.45 62.23,19.05 56.13,34.29 8,23.37 8,21.84 8,20.32 8,12.45 8,10.92 8,9.27 14.73,14.41 17.78,10.6 61.47,13.97 68.58,12.06 71.12,12.06 68.96,5.97 24.57,23.24 20.32,22.86 3.49,23.88 21.78,26.16
  pour Bottom (isolate 0.178): 0,50.8 76.2,50.8 76.2,0 0,0
  pour Top (isolate 0.178, rank 3): 0,50.8 76.2,50.8 76.2,0 0,0
  pour Top (isolate 0.203): 66.04,50.8 66.04,37.47 45.72,37.47 45.72,50.8
  pour Top (isolate 0.203): 10.29,50.8 10.29,37.47 30.48,37.47 30.48,50.8
  pour Route2 (isolate 0.178, rank 3): 0,50.8 76.2,50.8 76.2,0 0,0
N$1  (via drill 0.3)
  Top 0.61: v10.29,36.2 R6.2
  Bottom 0.61: v10.29,36.2 VIN_LED.1
N$2  (via drill 0.3)
  Top 0.305: R4.2 v64.01,17.78
  Bottom 0.305: v64.01,17.78 63.25,18.54 63.25,21.72 64.16,22.63 JP1.3
N$3  (via drill 0.3)
  Top 0.305: R1.2 v64.01,20.32
  Bottom 0.305: v64.01,20.32 64.24,20.55 JP1.1
N$4
  Top 0.61: F2.2 47.91,2.31 D3.A
N$5
  Top 0.203: J2.A5 16.53,7.56 R7.2
N$6  (via drill 0.3)
  Top 0.305: v10.29,38.23 9.23,38.23 R11.2
  Bottom 0.305: v10.29,38.23 3V3_LED.1
N$7
  Top 0.305: D2.A R11.1
N$8
  Top 0.305: D4.A R6.1
N$9
  Top 0.203: J2.B5 19.53,7.31 R8.2
N$10  (via drill 0.28)
  Top 0.203: J1.A5 v36.85,5.12 v36.86,5.11 | R2.2 v32.77,9.27
  Bottom 0.203: v36.86,5.11 36.86,6.32 35.56,7.62 33.53,7.62 32.77,8.38 v32.77,9.27
N$11  (via drill 0.28)
  Top 0.203: J1.B5 39.85,5.43 39.45,5.04 v39.27,5.04 | v44.83,6.48 44.83,7.58 R3.2
  Bottom 0.203: v39.27,5.04 41.85,7.62 43.69,7.62 v44.83,6.48
N$12
  Top 0.61: F1.2 27.59,2.31 D5.A
N$13
  Top 0.305: J2.VBUS1 15.4,5.94 15.4,5.49 16.64,4.25 16.64,4.06 | J2.VBUS2 20.23,5.5 18.8,4.06
  Top 0.61: 16.64,4.06 18.8,4.06 19.05,4.06 19.56,3.56 24.89,3.56 25.4,4.06 F1.1
N$14
  Top 0.203: J3.A5 55.9,7.56 R9.2
N$15
  Top 0.351: C18.2 19.57,40.13 L2.P$2 19.55,40.13 17.53,40.13 arc-90 16.51,41.15 E3.SIG
N$16
  Top 0.305: R23.2 C19.1 D10.1 19.76,37.52 19.56,37.72 L2.P$1
N$17
  Top 0.203: J3.B5 58.9,7.18 R10.2
N$18
  Top 0.305: J3.VBUS1 54.7,5.5 56.01,4.19 | J3.VBUS2 59.6,5.5 58.29,4.19
  Top 0.61: 56.01,4.19 58.29,4.19 58.93,3.56 64.26,3.56 64.77,4.06 F3.1
N$19
  Top 0.203: 35.78,5.88 J1.VBUS1
  Top 0.305: J1.VBUS2 40.42,5.88 40.42,5.31 39.31,4.19 | 36.89,4.19 35.78,5.31 35.78,5.88
  Top 0.61: 36.89,4.19 39.31,4.19 40.07,3.43 44.83,3.43 45.72,4.32 F2.1
N$20  (via drill 0.28)
  Top 0.203: U2.2 v34.92,9.21
  Bottom 0.203: v34.92,9.21 34.16,9.97 31.42,9.97 30.48,10.91 TX.1
N$21  (via drill 0.28)
  Top 0.203: U2.3 36.2,8.89 34.16,10.92 v33.02,10.92
  Bottom 0.203: v33.02,10.92 RX.1
N$22
  Top 0.254: U7.P8 U7.P7 R26.1
  Top 0.305: R26.1
N$23  (via drill 0.3)
  Top 0.305: v31.75,28 31.44,27.7 31.44,25.06 IC2.8
  Bottom 0.305: DSR_DIR.2 31.18,27.43 v31.75,28
N$24
  Top 0.305: U3.5 59.63,29.57 C17.1 C20.1 59.65,32.77 R24.1
N$25  (via drill 0.3)
  Top 0.305: FB1.1 59.65,37.97 C21.1 59.69,36.16 R24.2 59.48,34.29 v58.42,34.29
  Bottom 0.305: TP22.P$1 v58.42,34.29
N$26
  Top 0.305: Q2.1 47.24,23.26 R27.2
N$27
  Top 0.305: Q4.1 49.57,23.11 R28.2
N$28
  Top 0.305: U8.4 49.63,21.27 R28.1
N$29  (via drill 0.28)
  Top 0.203: U2.14 36.2,11.43 v35.56,10.79
  Bottom 0.203: v35.56,10.79 RTS.1
N$30  (via drill 0.28)
  Top 0.203: U2.13 37.47,11.43 v38.1,10.79
  Bottom 0.203: v38.1,10.79 DTR.1
N$31
  Top 0.61: U1.4 30.4,27.6 R31.2
N$32
  Top 0.305: Q1.1 R32.2
N$33  (via drill 0.28)
  Top 0.203: Q1.3 v12.45,32.51 12.45,38.23 10.67,40.01 R33.1 | v7.49,29.21 7.49,28.03 R38.1
  Top 0.305: R38.1 J13.1
  Bottom 0.203: v12.45,32.51 10.41,30.48 8.76,30.48 v7.49,29.21
N$34
  Top 0.305: D12.C R33.2
N$35
  Top 0.305: Q3.1 14.61,29.54 R34.2
N$36
  Top 0.203: R35.1 9.23,41.91 12.78,38.36 12.78,33.11 13.84,32.04 13.84,31.41 | R39.1 8.42,31.5 10.67,31.5 11.56,30.61 13.34,30.61 13.84,31.11 13.84,31.41 | Q3.3 13.84,31.41
  Top 0.305: R39.1 J19.1
N$37
  Top 0.305: D13.C R35.2
N$38
  Top 0.305: U1.13 40.3,28.32 41.06,27.56 R36.2
N$39
  Top 0.305: U1.12 39.2,27.69 R37.2
N$40
  Top 0.305: Q8.1 54.38,21.35 R13.2
N$41  (via drill 0.28)
  Top 0.203: U2.12 38.73,12.06 v40.01,10.79
  Bottom 0.203: v40.01,10.79 40.64,11.43 DCD.1
N$42
  Top 0.305: Q8.3 56.27,19.09 R25.2 58.18,18.89 Q9.1
N$43  (via drill 0.3)
  Top 0.305: Q5.2 50.1,46.48 v49.97,46.35 49.81,46.52 R29.1
  Bottom 0.305: JP19.2 51.12,46.16 50.93,46.35 v49.97,46.35
N$44  (via drill 0.28)
  Top 0.203: U2.11 40.01,12.06 41.27,10.79 v41.91,10.79
  Bottom 0.203: v41.91,10.79 42.55,10.79 43.18,11.43 RI.1
N$45  (via drill 0.28)
  Top 0.203: U2.10 41.27,12.38 43.12,10.54 v45.72,10.54
  Bottom 0.203: v45.72,10.54 DSR.1
N$46  (via drill 0.28)
  Top 0.203: U2.9 42.55,12.38 43.81,11.11 v48.26,11.11
  Bottom 0.203: v48.26,11.11 CTS.1
N$47
  Top 0.305: Q7.1 17.38,28.17 R42.2
N$48  (via drill 0.28)
  Top 0.203: U4.8 17.78,11.81 16.76,10.79 14.61,10.79 v13.97,11.43
  Bottom 0.203: v13.97,11.43 TX2.1
N$49
  Top 0.203: R43.2 D14.C
N$50  (via drill 0.28)
  Top 0.203: U4.9 17.28,12.2 v16.51,11.43
  Bottom 0.203: v16.51,11.43 RX2.1
N$51  (via drill 0.28)
  Top 0.203: U4.4 18.28,10.28 18.36,10.36 18.36,10.74 v19.05,11.43
  Bottom 0.203: v19.05,11.43 RTS2.1
N$52  (via drill 0.28)
  Top 0.203: U4.5 19.66,9.5 v21.59,11.43
  Bottom 0.203: v21.59,11.43 CTS2.1
N$53  (via drill 0.28)
  Top 0.203: R12.2 v10.29,32.38
  Bottom 0.203: v10.29,32.38 9.91,32 TX_LED.1
N$54
  Top 0.203: D7.A R12.1
N$55  (via drill 0.28)
  Top 0.203: R14.2 v10.29,34.29
  Bottom 0.203: v10.29,34.29 10.03,34.04 RX_LED.1
N$56
  Top 0.203: D9.A R14.1
N$57  (via drill 0.28)
  Top 0.61: F4.1 7.97,2.31 D1.A v6.87,2.66 v6.86,2.67 6.48,3.05 v6.48,3.3
  Bottom 0.559: v6.48,3.3 6.48,3.05 v6.86,2.67 7.37,2.67 7.62,2.92 DVEXT.1
N$58  (via drill 0.28)
  Top 0.203: v54.36,24.77 R13.1
  Bottom 0.203: v54.36,24.77 54.99,25.4 JP2.2
RI  (via drill 0.28)
  Top 0.203: IC2.12 v33.46,17.98 v33.47,17.97 33.47,17.67 33.15,17.35 32.18,17.35 32.07,17.46 24.57,17.46 v24,16.89
  Bottom 0.203: RI.2 SERIAL.7 41.54,16.88 39.83,16.88 37.93,18.77 33.89,18.77 33.47,18.35 v33.47,17.97 | v24,16.89 22.07,16.89 21.59,16.41 CTS2.2
RTS  (via drill 0.28)
  Top 0.203: IC1.11 39.54,18.2 38.61,17.27 33.78,17.27 33.4,16.89 31.88,16.89 v31.75,16.76 31.5,17.02 27.18,17.02 26.2,16.04 R19.2
  Bottom 0.203: RTS.2 SERIAL.4 34.04,16.76 v31.75,16.76
RX  (via drill 0.28)
  Top 0.203: D9.C 1.92,33.4 v3.81,33.4 | SERIAL.3 33.27,15.24 34.54,16.51 40.51,16.51 41.49,17.48 IC1.14
  Bottom 0.203: v3.81,33.4 4.45,32.77 4.45,28.32 6.73,26.04 15.37,26.04 16.76,24.64 22.1,24.64 25.4,21.34 25.4,17.78 26.67,16.51 31.11,16.51 32.38,15.24 SERIAL.3 RX.2
SARA_!ON!
  Top 0.203: Q7.3 17.31,32.13 14.48,32.13 13.11,33.5 13.11,38.5 10.16,41.45 10.16,42.76 R43.1
SARA_!RESET!
  Top 0.203: U1.18 45.8,28.43 46.8,27.43 47.24,27.43 47.72,26.96 Q4.3
SARA_ANT
  Top 0.351: C18.1 23.32,40.13 L1.P$1 23.42,40.13 U1.56
SARA_ANT_DET
  Top 0.305: U1.62 R23.1
SARA_ANT_GNSS
  Top 0.351: U1.31 53.31,41.23 D11.1 55.41,41.2 arc-45 56.77,40.64 56.95,40.46 arc45 58.75,39.71 FB1.2 E4.SIG
SARA_CTS_O  (via drill 0.3)
  Top 0.203: U1.11 38.1,28.57 37.85,28.32 37.02,28.32 36.83,28.13 36.83,26.67 37.29,26.21 39.95,26.21 40.19,25.98 IC1.5
  Top 0.305: IC1.5 40.19,23.49 v40.13,23.43
  Bottom 0.305: v40.13,23.43 40.13,24.64 TP3.P$1
SARA_DCD/RXD2O  (via drill 0.3)
  Top 0.305: U1.8 v34.8,27.94 34.11,27.25 IC2.4
  Bottom 0.305: v34.8,27.94 34.8,29.72 TP15.P$1
SARA_DSR/RTS2I  (via drill 0.3)
  Top 0.305: U1.6 32.6,27.98 v32.64,27.94 32.81,27.77 IC2.6
  Bottom 0.305: TP17.P$1 32.64,30.1 v32.64,27.94
SARA_DTR/TXD2I  (via drill 0.3)
  Top 0.305: U1.9 35.94,29.84 35.94,28.07 v35.81,27.94 34.76,26.88 IC2.3
  Bottom 0.305: v35.81,27.94 36.07,27.69 36.07,25.91 TP14.P$1
SARA_EXT_INT  (via drill 0.3)
  Top 0.305: U1.33 49.1,45.23 v49.15,45.28
  Bottom 0.305: v49.15,45.28 49.34,45.09 JP19.3
SARA_GPIO2  (via drill 0.28)
  Top 0.305: U1.23 51.39,32.43 52.07,31.75 52.07,29.21 v53.34,27.94
  Bottom 0.305: v53.34,27.94 56.01,27.94 57.51,26.44 JP2.1
SARA_GPIO3  (via drill 0.3)
  Top 0.305: U1.24 51.43,33.53 53.85,31.11 55.5,31.11 56.9,32.51 56.9,34.92 53.6,38.22 v53.4,38.22
  Bottom 0.305: v53.4,38.22 53.28,38.1 44.07,38.1 42.67,39.5 42.67,42.67 44.01,44.01 51.94,44.01 52.16,44.22 JP19.1
SARA_INT  (via drill 0.28, 0.3)
  Top 0.203: v21.08,26.54 18.8,24.26 15.49,24.26 14.86,24.89 3.3,24.89 J5.2
  Top 0.305: Q5.3 51.99,47.67 v52.2,47.88 52.41,48.09 R30.1
  Bottom 0.203: v52.2,47.88 51.31,46.99 40.64,46.99 33.02,39.37 33.02,35.56 31.75,34.29 28.83,34.29 v21.08,26.54
SARA_NI  (via drill 0.28, 0.3)
  Top 0.203: U1.16 43.67,29.81 43.67,28.93 44.64,27.96 v44.64,27.88 | R34.1 15.84,26.45 v16.26,26.04
  Bottom 0.203: v16.26,26.04 17.65,26.04 18.67,25.02 22.99,25.02 29.34,31.37 44.2,31.37 44.64,30.92 v44.64,27.88
SARA_ON
  Top 0.203: J5.1 14.99,25.4 15.75,24.64 18.29,24.64 19.05,25.4 R18.1 19.77,27.18 22.73,27.18 23.5,26.42 23.5,22.86 24,22.35 26.29,22.35 26.67,22.35 34.8,22.35 35.43,21.72 42.67,21.72 44.07,20.32 46.19,20.32 R27.1
SARA_ON_1.8V  (via drill 0.28)
  Top 0.203: U1.15 42.5,28.62 42.8,28.32 43.56,28.32 43.91,27.98 Q2.3 43.91,23.08 v43.69,22.86 | S3.1 74.93,15.24 73.66,16.51 v56.39,16.51
  Top 0.305: S3.2 S3.1
  Bottom 0.203: v43.69,22.86 44.02,23.19 52,23.19 56.39,18.8 v56.39,16.51
SARA_RI/CTS2O  (via drill 0.3)
  Top 0.305: U1.7 33.66,29.84 v33.66,27.94 33.46,27.74 IC2.5
  Bottom 0.305: v33.66,27.94 33.66,26.04 TP16.P$1
SARA_RTS_I  (via drill 0.3)
  Top 0.203: U1.10 37,28.87 36.5,28.37 36.5,26.49 36.52,26.47 36.52,26.12 v37.15,25.5
  Top 0.305: IC1.6 39.54,23.85 v39.43,23.75
  Bottom 0.305: v39.43,23.75 38.1,25.08 38.1,25.5 | 38.1,25.5 v37.15,25.5 | TP4.P$1 38.1,25.5
SARA_RXD_O  (via drill 0.3)
  Top 0.203: R36.1 41.49,26.16 IC1.3
  Top 0.305: IC1.3 41.49,23.47 v41.53,23.43
  Bottom 0.305: v41.53,23.43 41.53,25.02 TP1.P$1
SARA_SCL  (via drill 0.3)
  Top 0.254: U7.P6 54.36,29.28 v53.72,28.64
  Top 0.305: R4.1 J14.4
  Bottom 0.305: v53.72,28.64 54.29,29.21 62.74,29.21 74.17,17.78 J14.4
SARA_SCL_1.8V  (via drill 0.3)
  Top 0.254: v54.61,31.75 54.36,32 U7.P3 54.36,34.13 51.66,36.83 U1.27
  Bottom 0.305: TP10.P$1 v54.61,31.75
SARA_SDA  (via drill 0.3)
  Top 0.254: U7.P5 53.86,29.86 53.28,29.27 v53.15,29.27
  Top 0.305: R1.1 J14.3
  Bottom 0.305: J14.3 73.91,19.3 73.41,19.3 63.06,29.65 53.53,29.65 v53.15,29.27
SARA_SDA_1.8V  (via drill 0.3)
  Top 0.254: U1.26 52.15,35.73 53.86,34.02 U7.P4 53.17,33.3
  Top 0.305: v53.15,33.27 53.17,33.3
  Bottom 0.305: TP9.P$1 53.15,30.67 v53.15,33.27
SARA_TP  (via drill 0.28, 0.3)
  Top 0.203: U1.19 46.99,29.79 v46.99,28.07 | R32.1 12.03,26.67 v13.21,26.67
  Bottom 0.203: v13.21,26.67 17.78,26.67 19.05,25.4 22.86,25.4 29.21,31.75 46.35,31.75 46.99,31.11 v46.99,28.07
SARA_TXD_I  (via drill 0.3)
  Top 0.203: R37.1 38.65,26.54 40.51,26.54 40.84,26.22 IC1.4
  Top 0.305: IC1.4 v40.84,23.82 v40.83,23.81
  Bottom 0.305: v40.83,23.81 40.83,30.29 TP2.P$1
SARA_USB_D+  (via drill 0.28)
  Top 0.203: J3.A6 56.9,5.29 v57.15,5.04 57.74,5.04 57.9,5.2 J3.B6
  Top 0.305: U1.29 51.52,39.03 v55.24,35.31
  Bottom 0.305: v55.24,35.31 54.99,35.31 54.48,34.8 53.34,34.8 52.52,33.98 52.52,24.7 57.91,19.3 57.91,5.8 v57.15,5.04
SARA_USB_D-  (via drill 0.28)
  Top 0.203: J3.B7 56.4,6.62 56.64,6.86 57.15,6.86 | J3.A7 57.4,6.61 57.15,6.86 | 57.15,6.86 v57.15,8.5
  Top 0.305: v54.1,35.43 54.02,35.43 51.49,37.96 50.08,37.96 U1.28
  Bottom 0.305: v57.15,8.5 57.15,19.05 51.82,24.38 51.82,34.16 53.09,35.43 v54.1,35.43
SARA_VUSB_DET  (via drill 0.28)
  Top 0.203: U1.17 44.7,28.83 45.85,27.69 v45.85,27.05 | v62.87,2.29 64.75,2.29 F3.2
  Top 0.61: F3.2 66.96,2.31 D6.A 67.61,2.96 R16.2
  Bottom 0.203: v45.85,27.05 43.05,24.26 43.05,22.61 43.63,22.02 52.27,22.02 55.75,18.54 55.75,15.88 56.64,14.99 56.64,8.8 56.58,8.74 56.58,4.64 57.66,3.56 61.59,3.56 v62.87,2.29
SIM_CLK  (via drill 0.3)
  Top 0.305: U1.38 43.6,45 v43.81,45.21 45.85,45.21 46.1,45.47 C8.1 46.9,46.52 47.37,46.99 47.37,49.4 46.93,49.85 44.51,49.85 43.44,48.77 D8.1 | J17.C3 v65.15,31.11
  Bottom 0.305: v65.15,31.11 65.15,34.29 61.85,37.59 43.75,37.59 42.16,39.18 42.16,43.56 v43.81,45.21
SIM_IO  (via drill 0.3)
  Top 0.305: U1.39 42.5,44.91 v42.86,45.27 D8.6 42.91,46.52 C10.2 | J17.C7 v64.52,29.84
  Bottom 0.305: v64.52,29.84 64.52,34.16 61.59,37.08 43.37,37.08 41.59,38.86 41.59,44 v42.86,45.27
SIM_RST  (via drill 0.3)
  Top 0.305: U1.40 41.4,44.83 v40.96,45.27 D8.4 40.91,46.52 C7.1 | J17.C2 61.85,32.38 61.59,32.64 v61.59,34.29
  Bottom 0.305: v61.59,34.29 62.23,34.92 62.23,35.69 61.34,36.58 42.99,36.58 40.96,38.6 v40.96,45.27
TX  (via drill 0.28)
  Top 0.203: D7.C 1.16,32.38 2.04,31.5 v3.68,31.5 | IC1.13 40.84,17.6 40.15,16.9 34.18,16.9 33.78,16.51 32.38,16.51 31.11,15.24 SERIAL.2
  Bottom 0.203: v3.68,31.5 3.68,28.45 6.48,25.65 15.24,25.65 16.59,24.31 21.92,24.31 25.02,21.21 25.02,15.62 26.67,13.97 29.21,13.97 SERIAL.2 TX.2
USB_2_D+  (via drill 0.28)
  Top 0.203: J2.A6 v17.53,5.07 18.4,5.07 18.53,5.2 J2.B6 | U4.1 16.78,8.61 v16.8,8.59
  Bottom 0.203: v16.8,8.59 17.53,7.86 v17.53,5.07
USB_2_D-
  Top 0.203: U4.2 17.33,9.45 17.33,8.87 18.03,8.17 18.03,6.86 | 18.03,6.86 J2.A7 | J2.B7 17.08,6.06 17.08,6.63 17.3,6.86 18.03,6.86
USB_D+
  Top 0.203: J1.B6 38.85,7.11 | 38.85,7.11 38.85,7.5 U2.5 | 38.85,7.11 38.38,7.11 37.85,6.59 J1.A6
USB_D-  (via drill 0.28)
  Top 0.203: U2.6 v40.01,8.76 | J1.A7 38.35,5.22 v38.1,4.97 38.09,4.95 37.83,4.95 37.35,5.43 J1.B7
  Bottom 0.203: v40.01,8.76 39.99,8.76 38.1,6.87 v38.1,4.97
V_EXT  (via drill 0.28)
  Top 0.813: v10.79,3.81 10.79,4.67 F4.2 9.65,4.8 v9.65,3.81
  Bottom 0.813: v9.65,3.81 10.16,3.81 | 10.16,3.81 v10.79,3.81 | 10.16,3.81 10.16,4.7 4.7,10.16 J5.7
VCCIO  (via drill 0.28, 0.3)
  Top 0.254: U7.P2 54.86,34.08 v55.06,34.28 | IC1.7 38.83,24.93 38.83,23.15 39.24,22.73 42.35,22.73 42.85,23.23 42.85,24.93 IC1.1
  Top 0.305: Q5.1 50.29,47.49 v50.05,47.74 49.57,48.22 R29.2 | C22.1 v44.83,24.26 | IC2.2 35.41,26.25 v35.43,26.28 | IC2.7 32.16,26.25 v32.13,26.28 | v42.8,26.28 IC1.1 | v43.75,19.05 43.6,19.2 IC1.16 | v37.08,19.81 37.08,19.78 36.5,19.2 IC2.16
  Top 0.61: R42.1 v17.4,25.27 v17.39,25.27 | C23.1 v30.61,19.3 | R31.1 27.32,27.56 v27.31,27.55 v27.31,26.28 v28.71,26.28 28.74,26.31 R31.1
  Route15 0.61: v50.05,47.74 43.18,40.88 43.18,34.29 43.19,34.28 | 43.19,34.28 v55.06,34.28 55.06,33.46 55.63,32.89 55.63,29.59 56.52,28.7 v56.52,23.5 | v27.31,27.55 v27.31,26.28 | v27.31,26.28 v28.71,26.28 v32.13,26.28 v35.43,26.28 v42.8,26.28 | v42.8,26.28 v42.79,26.28 43.19,26.68 43.19,34.28 | v27.31,26.28 27.31,25.27 27.3,25.27 | v44.83,24.26 v42.81,26.28 v42.8,26.28 | v43.75,19.05 42.99,19.81 v37.08,19.81 32.38,19.81 31.88,19.3 v30.61,19.3 28.96,19.3 27.3,20.95 27.3,25.27 | 27.3,25.27 v17.39,25.27 17.35,25.27 16.96,24.88 7.1,24.88 5.08,22.86 5.08,19.05 J5.5
  Bottom 0.203: JP2.3 57.38,24.36 v56.52,23.5
  Bottom 0.305: DSR_DIR.3 28.82,26.39 v28.71,26.28
VIN  (via drill 0.28)
  Top 0.305: U5.8 11.13,14.1 R5.2 v12.19,13.97 | U3.1 59.63,23.69 59.05,23.11 v58.67,23.11
  Top 0.61: R5.2 C1.1 C13.1 11.06,10.87 C26.1 11.06,8.14 10.54,7.62 v10.16,7.62 v8.89,7.62 7.62,6.35 D1.C v6.87,4.96 v6.86,4.95 6.48,4.57 v6.48,4.32 | v67.31,7.62 D6.C | D3.C v48.26,7.62 | D5.C v27.94,7.62
  Top 0.813: v68.58,7.62 v67.31,7.62 | v48.26,7.62 v49.53,7.62 | v27.94,7.62 v26.67,7.62
  Route15 0.305: v58.67,23.11 59.31,22.48 59.31,7.62
  Route15 0.813: v8.89,7.62 v10.16,7.62 v26.67,7.62 v27.94,7.62 v48.26,7.62 v49.53,7.62 59.31,7.62 v67.31,7.62 v68.58,7.62
  Bottom 0.203: v12.19,13.97 12.19,19.81 13.34,20.95 13.34,21.97 10.16,25.15 6.22,25.15 2.92,28.45 2.92,34.54 4.57,36.2 VIN_LED.2
  Bottom 0.559: v6.48,4.32 6.48,4.57 v6.86,4.95 7.37,4.95 7.62,4.7 DVEXT.2
VREG_3.3V
  Top 0.305: U5.1 11.13,20.2 C3.1
  Top 0.61: C3.1 C4.1 C5.1
  Top 0.813: MEAS.3 13.59,22.86 13.08,23.37 C5.1
  Bottom 0.305: MEAS.1 MEAS.3
VSIM  (via drill 0.3)
  Top 0.305: D8.3 40.38,48.77 39.24,49.91 35.43,49.91 34.92,49.4 34.92,46.86 35.27,46.52 C12.2 C11.2 37.72,45.47 37.97,45.21 40.13,45.21 40.3,45.04 U1.41 40.13,43.61 40.13,42.67 40.01,42.55 v40.01,42.42 | J17.C1 61.98,34.92 v61.59,35.31
  Bottom 0.305: v61.59,35.31 61.59,35.56 61.09,36.07 42.61,36.07 40.01,38.67 v40.01,42.42

## Text on the board
Top: 1
Route2: 2
Route15: 3
Bottom: V10 | 4
Measures: Dimensions are in inches
tDocu: 4-Layer PCB | 1.6mm Thickness | HASL Finish | Paul Clark